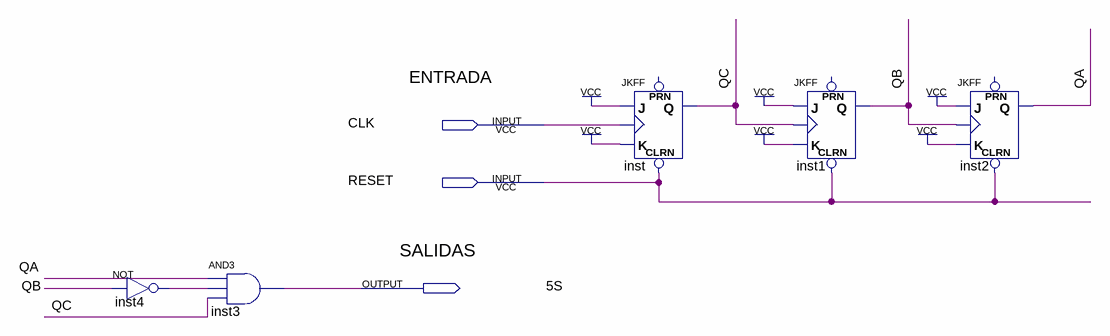
[diagram p0: schematic sheet]
// Quartus schematic contador_de_cinco.bdf as structural Verilog: 5 symbols, 3 pins
module contador_de_cinco (
  input  CLK,
  input  RESET,
  output \5S 
);

  wire inst4_out, QA, QB, QC;

  not inst4 (inst4_out, QB);
  and inst3 (\5S , QA, inst4_out, QC);
  JKFF inst (.CLRN(RESET), .K(1'b1), .J(1'b1), .CLK(CLK), .Q(QC));  // open: PRN
  JKFF inst1 (.CLRN(RESET), .K(1'b1), .J(1'b1), .CLK(QC), .Q(QB));  // open: PRN
  JKFF inst2 (.CLRN(RESET), .K(1'b1), .J(1'b1), .CLK(QB), .Q(QA));  // open: PRN

  // Notes on the sheet:
  //   ENTRADA
  //   SALIDAS
endmodule
